# Altium schematic sheet MCU.SchDoc: ESP32-PICO, STM32F4
size 420 x 297 mm; SheetNumber: 6
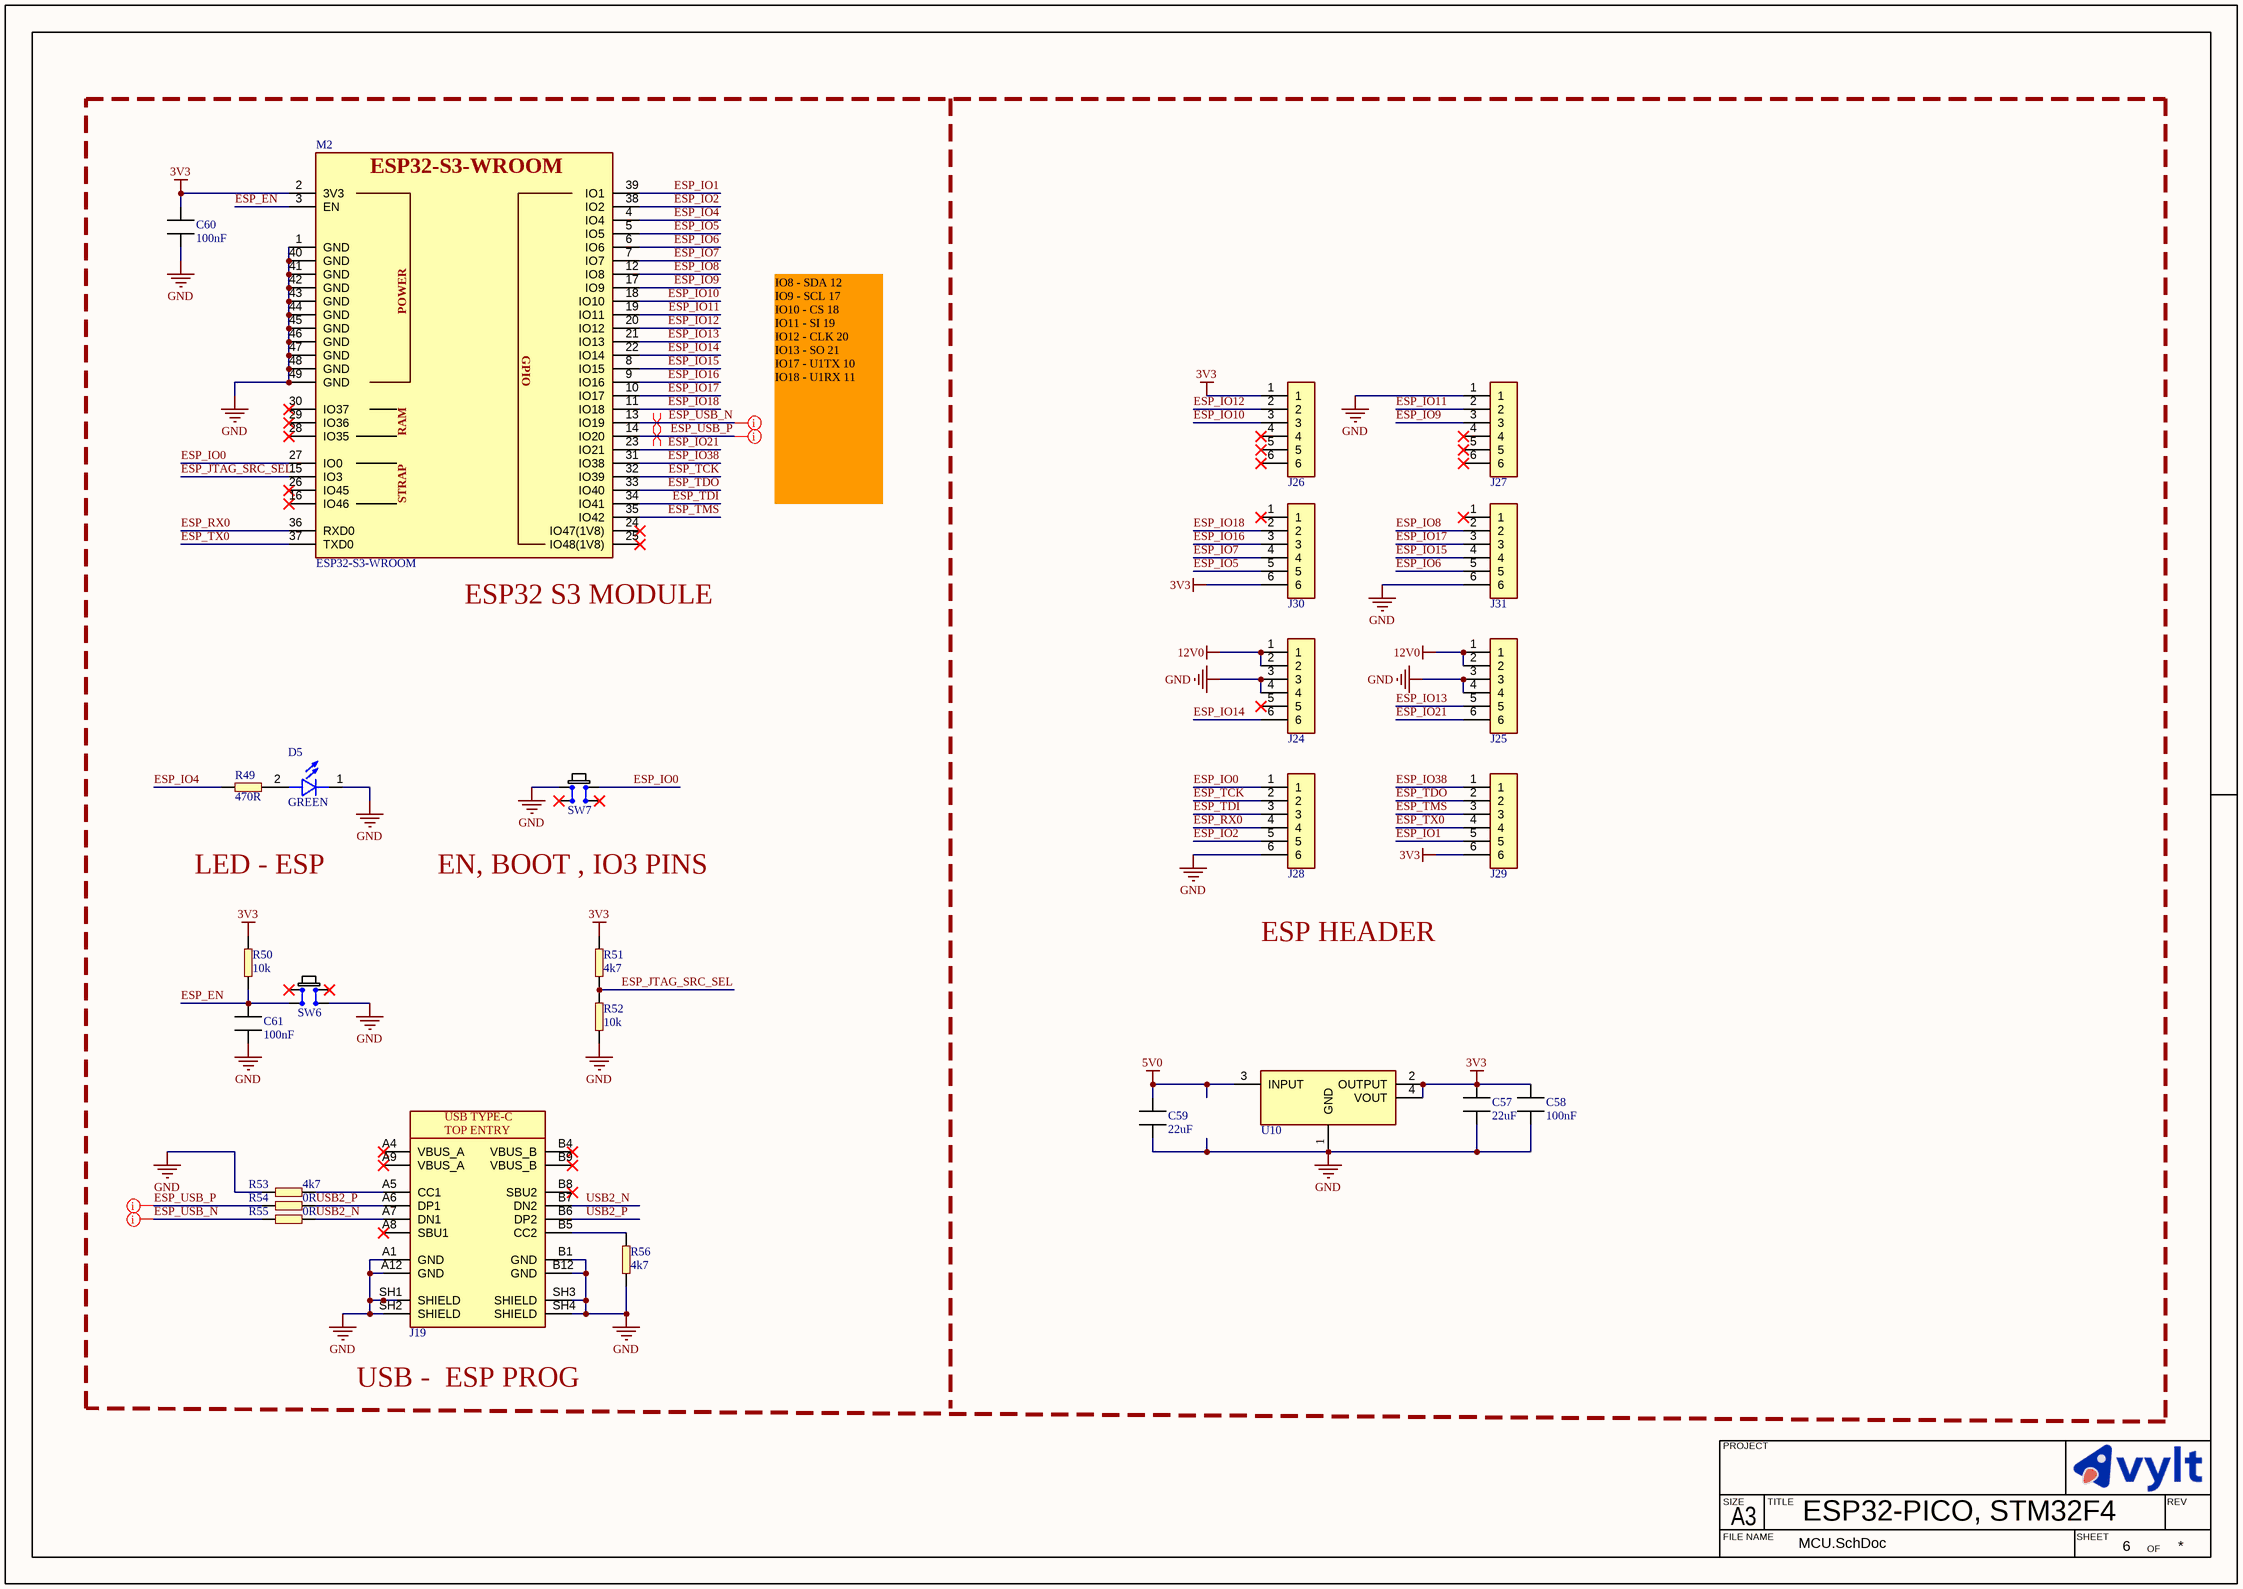
[diagram p0: MCU.SchDoc]

## Parts
C57  value 22uF  [CAPC2012X13L]  (hidden comment: MLCC_0805)
C58  value 100nF  [CAPC2012X13L]  (hidden comment: MLCC_0805)
C59  value 22uF  [CAPC2012X13L]  (hidden comment: MLCC_0805)
C60  value 100nF  [CAPC2012X13L]  (hidden comment: MLCC_0805)
C61  value 100nF  [CAPC2012X13L]  (hidden comment: MLCC_0805)
D5  value GREEN  [LED_1206]  (hidden comment: LED_1206)
J19  GSB1CA11101DSHR  [GSB1CA11101DSHR]  (value not drawn)
J24  ERP_148-2  [6PX1R_F]  (value not drawn)
J25  ERP_148-2  [6PX1R_F]  (value not drawn)
J26  ERP_148-2  [6PX1R_F]  (value not drawn)
J27  ERP_148-2  [6PX1R_F]  (value not drawn)
J28  ERP_148-2  [6PX1R_F]  (value not drawn)
J29  ERP_148-2  [6PX1R_F]  (value not drawn)
J30  ERP_148-2  [6PX1R_F]  (value not drawn)
J31  ERP_148-2  [6PX1R_F]  (value not drawn)
M2  value ESP32-S3-WROOM  [ESP32-S3-WROOM-1]  (hidden comment: ESP32-S3-WROOM-1(U))
R49  value 470R  [RES_0603]  (hidden comment: ERP_101-1)
R50  value 10k  [RES_0603]  (hidden comment: ERP_101-1)
R51  value 4k7  [RES_0603]  (hidden comment: ERP_101-1)
R52  value 10k  [RES_0603]  (hidden comment: ERP_101-1)
R53  value 4k7  [RES_0603]  (hidden comment: ERP_101-1)
R54  value 0R  [RES_0603]  (hidden comment: ERP_101-1)
R55  value 0R  [RES_0603]  (hidden comment: ERP_101-1)
R56  value 4k7  [RES_0603]  (hidden comment: ERP_101-1)
SW6  Generic6X6  [Generic6X6]  (value not drawn)
SW7  Generic6X6  [Generic6X6]  (value not drawn)
U10  ERP_123-1  [AMS1117_SOT223]  (value not drawn)

## Nets
3V3: C57.1 C58.1 C60.1 J26.1 J29.6 J30.6 M2.2(3V3) R50.2 R51.2 U10.2(OUTPUT) U10.4(VOUT)
5V0: C59.1 U10.3(INPUT)
12V0: J24.1 J24.2 J25.1 J25.2
GND: C57.2 C58.2 C59.2 C60.2 C61.2 D5.1 J19.A1(GND) J19.A12(GND) J19.B1(GND) J19.B12(GND) J19.SH1(SHIELD) J19.SH2(SHIELD) J19.SH3(SHIELD) J19.SH4(SHIELD) J24.3 J24.4 J25.3 J25.4 J27.1 J28.6 J31.6 M2.1(GND) M2.40(GND) M2.41(GND) M2.42(GND) M2.43(GND) M2.44(GND) M2.45(GND) M2.46(GND) M2.47(GND) M2.48(GND) M2.49(GND) R52.1 R53.2 R56.2 SW6.4(COM) SW7.1(NO) U10.1(GND)
ESP_EN: C61.1 M2.3(EN) R50.1 SW6.2(NO)
ESP_IO0: J28.1 M2.27(IO0) SW7.3(COM)
ESP_IO1: J29.5 M2.39(IO1)
ESP_IO2: J28.5 M2.38(IO2)
ESP_IO4: M2.4(IO4) R49.2
ESP_IO5: J30.5 M2.5(IO5)
ESP_IO6: J31.5 M2.6(IO6)
ESP_IO7: J30.4 M2.7(IO7)
ESP_IO8: J31.2 M2.12(IO8)
ESP_IO9: J27.3 M2.17(IO9)
ESP_IO10: J26.3 M2.18(IO10)
ESP_IO11: J27.2 M2.19(IO11)
ESP_IO12: J26.2 M2.20(IO12)
ESP_IO13: J25.5 M2.21(IO13)
ESP_IO14: J24.6 M2.22(IO14)
ESP_IO15: J31.4 M2.8(IO15)
ESP_IO16: J30.3 M2.9(IO16)
ESP_IO17: J31.3 M2.10(IO17)
ESP_IO18: J30.2 M2.11(IO18)
ESP_IO21: J25.6 M2.23(IO21)
ESP_IO38: J29.1 M2.31(IO38)
ESP_JTAG_SRC_SEL: M2.15(IO3) R51.1 R52.2
ESP_RX0: J28.4 M2.36(RXD0)
ESP_TCK: J28.2 M2.32(IO39)
ESP_TDI: J28.3 M2.34(IO41)
ESP_TDO: J29.2 M2.33(IO40)
ESP_TMS: J29.3 M2.35(IO42)
ESP_TX0: J29.4 M2.37(TXD0)
ESP_USB_N: M2.13(IO19) R55.2
ESP_USB_P: M2.14(IO20) R54.2
USB2_N: J19.A7(DN1) J19.B7(DN2) R55.1
USB2_P: J19.A6(DP1) J19.B6(DP2) R54.1
NetD5_2: D5.2 R49.1
NetJ19_A5: J19.A5(CC1) R53.1
NetJ19_B5: J19.B5(CC2) R56.1

Not connected (* = marked no-connect by the designer): J19 A4(VBUS_A)* A8(SBU1)* A9(VBUS_A)* B4(VBUS_B)* B8(SBU2)* B9(VBUS_B)*; J24 5*; J26 4* 5* 6*; J27 4* 5* 6*; J30 1*; J31 1*; M2 16(IO46)* 24(IO47(1V8))* 25(IO48(1V8))* 26(IO45)* 28(IO35)* 29(IO36)* 30(IO37)*; SW6 1(NO)* 3(COM)*; SW7 2(NO)* 4(COM)*

## Layout directives
rule Differential Pairs Routing [Pref Gap = 10mil    Min Gap  = 10mil    Max Gap  = 10milPref Width = 12.778mil    Min Width  = 12.778mil    Max Width  = 12.778mil]; rule Routing Via Style [Pref Size = 0.7mm    Pref Hole Size = 0.4mm]: ESP_USB_N, ESP_USB_P
differential pair: ESP_USB_N, ESP_USB_P
rule Differential Pairs Routing [Pref Gap = 10mil    Min Gap  = 10mil    Max Gap  = 10milPref Width = 12.778mil    Min Width  = 12.778mil    Max Width  = 12.778mil]: ESP_USB_N, ESP_USB_P

## Notes on the sheet
- IO8 - SDA 12
  IO9 - SCL 17
  IO10 - CS 18
  IO11 - SI 19
  IO12 - CLK 20
  IO13 - SO 21
  IO17 - U1TX 10
  IO18 - U1RX 11
- (near M2) ESP32 S3 MODULE
- LED - ESP
- EN, BOOT , IO3 PINS
- ESP HEADER
- (near J19) USB -  ESP PROG
- PROJECT
- SIZE
- FILE NAME
- A3
- TITLE
- SHEET
- OF
- REV
- (in symbol ESP32-S3-WROOM-1(U)) POWER; GPIO; RAM; STRAP
- (in symbol GSB1CA11101DSHR) USB TYPE-C; TOP ENTRY

## Library data of the parts
C57-C61 = MLCC_0805: Chip Capacitor, 2-Leads, Body 2.00x1.25mm, IPC High Density; Package: 0805; Manufacturer 1: *; Manufacturer Part Number 1: *
D5 = LED_1206: LED CLEAR 1206 SMD; Manufacturer Part Number 1: 6395; Manufacturer 1: Sunrom
J19 = GSB1CA11101DSHR: USB-C (USB TYPE-C) USB 2.0 Receptacle Connector 24 (16+8 Dummy) Position Surface Mount, Through Hole; Manufacturer 1: Amphenol ICC (Commercial Products); Value: MUP-U23010-02; Manufacturer Part Number 1: GSB1CA11101DSHR; Package: 24 (16+8 Dummy)
J24-J31 = 6PX1R_F: 6PX1R Female Header; Value: *; Manufacturer 1: *; Manufacturer Part Number 1: *
M2 = ESP32-S3-WROOM-1(U): ESP32-S3-WROOM 1/1U Module; Manufacturer 1: Espressif Systems; Manufacturer Part Number 1: *; Package: *
R49-R56 = RES_0603: Package: 0603; Manufacturer 1: *; Manufacturer Part Number 1: *
  R49: ERP: *
SW6 SW7 = Generic6X6: Tactile Switch SPST-NO Top Actuated Surface Mount; Manufacturer 1: C&K; Manufacturer Part Number 1: *; Package: 4.5X4.5
U10 = AMS1117_SOT223: AMS1117 LDO; Manufacturer 1: TI; Supplier  Part Number 1: *; Supplier  1: *; Package: SOT223; Manufacturer Part Number 1: *